# EAGLE design WRIST (EAGLE 9.6.2)
COMPANY: ADAFRUIT INDUSTRIES; DRAWN: KTOWN; REV: A
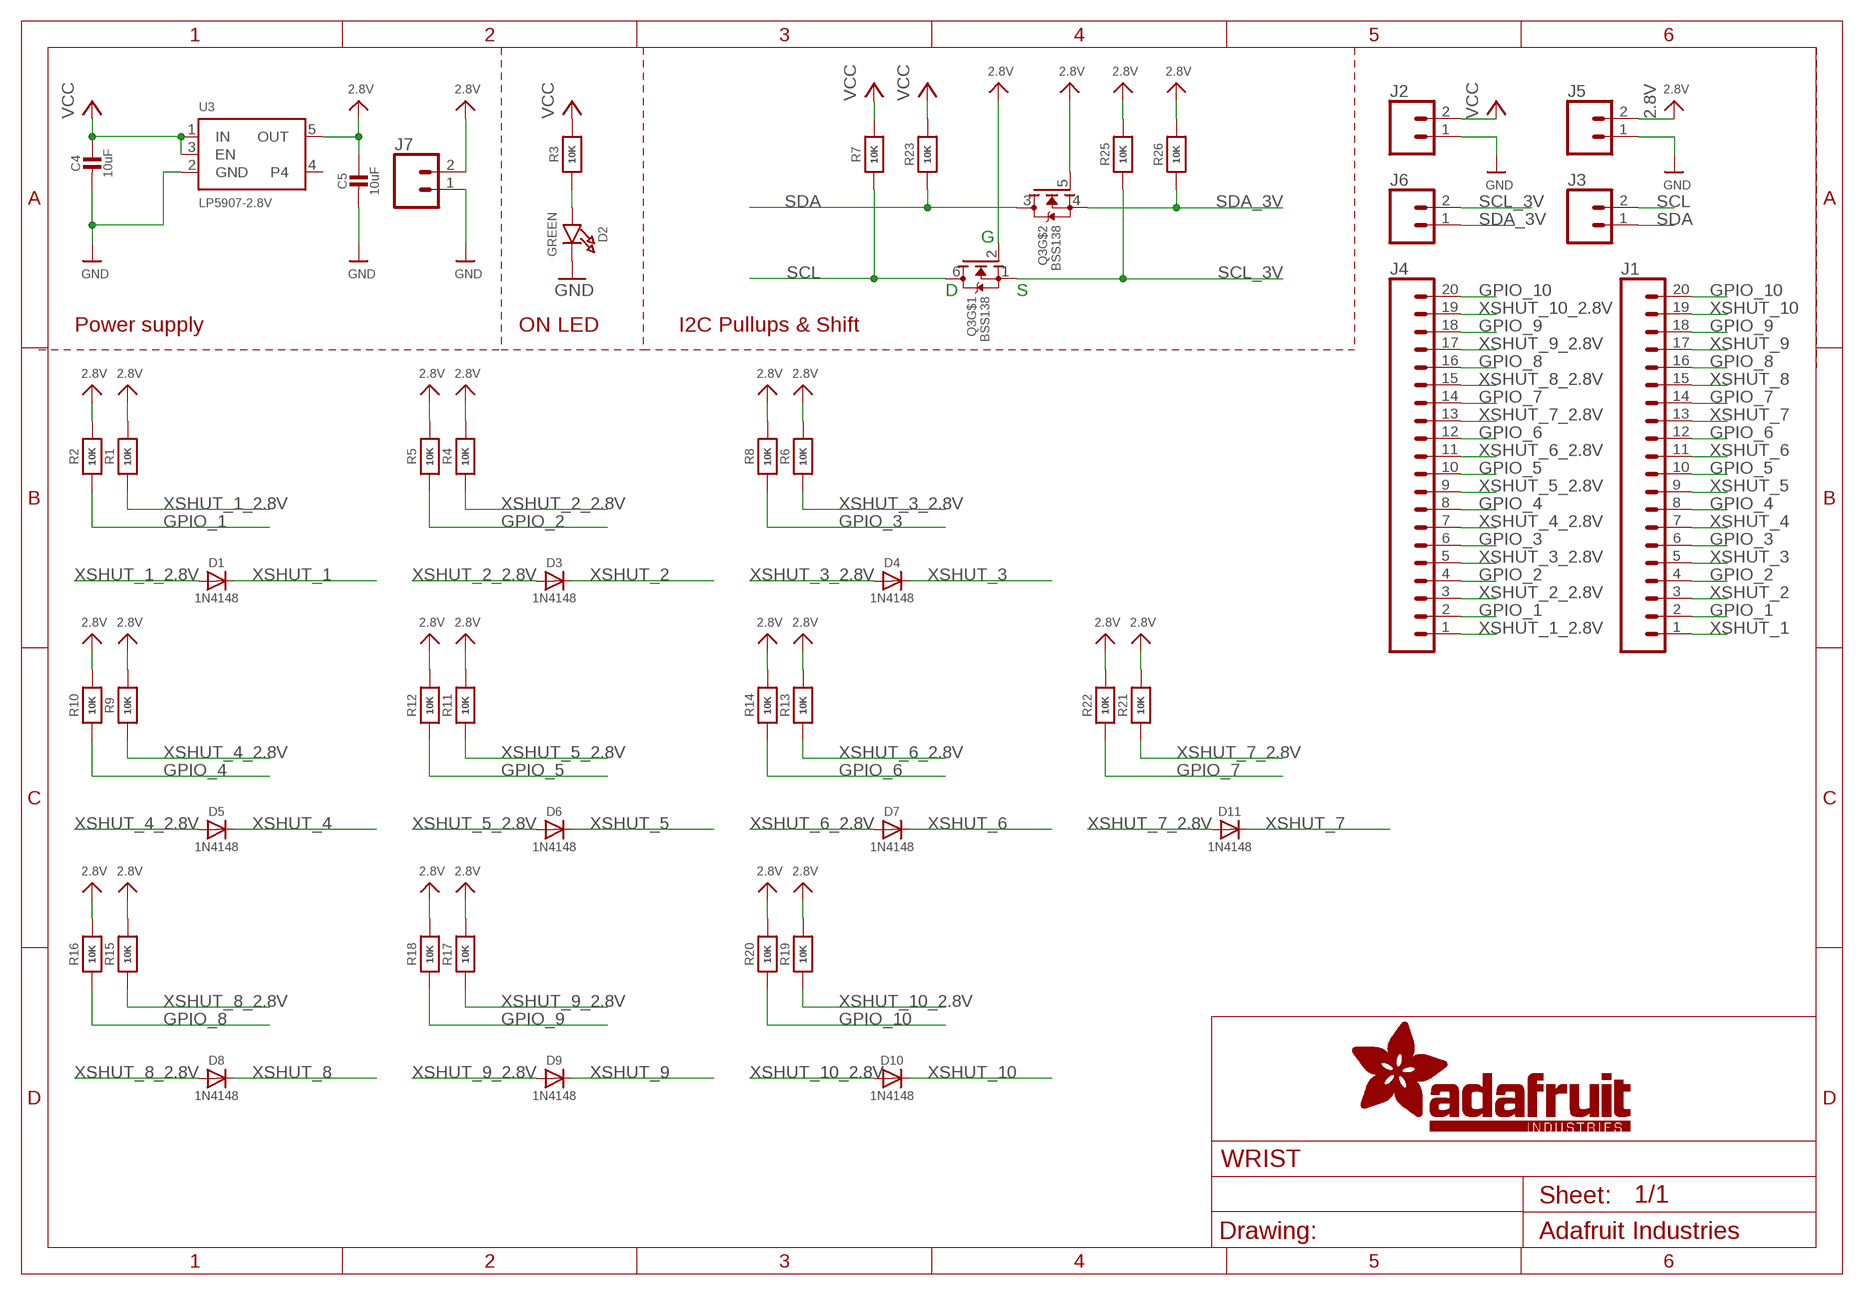
[diagram p0: schematic, sheet 1]

## Parts
C4  10uF  CAP_CERAMIC0805-NOOUTLINE  [0805-NO]
C5  10uF  CAP_CERAMIC0805-NOOUTLINE  [0805-NO]
D1  1N4148  DIODESOD-323  [SOD-323]
D2  GREEN  LED0603_NOOUTLINE  [CHIPLED_0603_NOOUTLINE]
D3  1N4148  DIODESOD-323  [SOD-323]
D4  1N4148  DIODESOD-323  [SOD-323]
D5  1N4148  DIODESOD-323  [SOD-323]
D6  1N4148  DIODESOD-323  [SOD-323]
D7  1N4148  DIODESOD-323  [SOD-323]
D8  1N4148  DIODESOD-323  [SOD-323]
D9  1N4148  DIODESOD-323  [SOD-323]
D10  1N4148  DIODESOD-323  [SOD-323]
D11  1N4148  DIODESOD-323  [SOD-323]
J1  CONN_20NOSILK  [1X20_NOSILK]
J2  CONN_021X02_NO_SILK  [1X02_NO_SILK]
J3  CONN_021X02_NO_SILK  [1X02_NO_SILK]
J4  CONN_20NOSILK  [1X20_NOSILK]
J5  CONN_021X02_NO_SILK  [1X02_NO_SILK]
J6  CONN_021X02_NO_SILK  [1X02_NO_SILK]
J7  CONN_021X02_NO_SILK  [1X02_NO_SILK]
Q3  BSS138  MOSFET-N_DUAL  [SOT363]
R1  10K  RESISTOR_0603_NOOUT  [0603-NO]
R2  10K  RESISTOR_0603_NOOUT  [0603-NO]
R3  10K  RESISTOR_0603_NOOUT  [0603-NO]
R4  10K  RESISTOR_0603_NOOUT  [0603-NO]
R5  10K  RESISTOR_0603_NOOUT  [0603-NO]
R6  10K  RESISTOR_0603_NOOUT  [0603-NO]
R7  10K  RESISTOR_0603_NOOUT  [0603-NO]
R8  10K  RESISTOR_0603_NOOUT  [0603-NO]
R9  10K  RESISTOR_0603_NOOUT  [0603-NO]
R10  10K  RESISTOR_0603_NOOUT  [0603-NO]
R11  10K  RESISTOR_0603_NOOUT  [0603-NO]
R12  10K  RESISTOR_0603_NOOUT  [0603-NO]
R13  10K  RESISTOR_0603_NOOUT  [0603-NO]
R14  10K  RESISTOR_0603_NOOUT  [0603-NO]
R15  10K  RESISTOR_0603_NOOUT  [0603-NO]
R16  10K  RESISTOR_0603_NOOUT  [0603-NO]
R17  10K  RESISTOR_0603_NOOUT  [0603-NO]
R18  10K  RESISTOR_0603_NOOUT  [0603-NO]
R19  10K  RESISTOR_0603_NOOUT  [0603-NO]
R20  10K  RESISTOR_0603_NOOUT  [0603-NO]
R21  10K  RESISTOR_0603_NOOUT  [0603-NO]
R22  10K  RESISTOR_0603_NOOUT  [0603-NO]
R23  10K  RESISTOR_0603_NOOUT  [0603-NO]
R25  10K  RESISTOR_0603_NOOUT  [0603-NO]
R26  10K  RESISTOR_0603_NOOUT  [0603-NO]
U3  LP5907-2.8V  VREG_SOT23-5  [SOT23-5]

## Nets
2.8V: C5.1 J5.2 J7.2 Q3.2(G) Q3.5(G) R1.2 R2.2 R4.2 R5.2 R6.2 R8.2 R9.2 R10.2 R11.2 R12.2 R13.2 R14.2 R15.2 R16.2 R17.2 R18.2 R19.2 R20.2 R21.2 R22.2 R25.2 R26.2 U3.5(OUT)
GND: C4.2 C5.2 D2.C J2.1 J5.1 J7.1 U3.2(GND)
GPIO_1: J1.2 J4.2 R2.1
GPIO_2: J1.4 J4.4 R5.1
GPIO_3: J1.6 J4.6 R8.1
GPIO_4: J1.8 J4.8 R10.1
GPIO_5: J1.10 J4.10 R12.1
GPIO_6: J1.12 J4.12 R14.1
GPIO_7: J1.14 J4.14 R22.1
GPIO_8: J1.16 J4.16 R16.1
GPIO_9: J1.18 J4.18 R18.1
GPIO_10: J1.20 J4.20 R20.1
N$1: D2.A R3.1
SCL: J3.2 Q3.6(D) R7.1
SCL_3V: J6.2 Q3.1(S) R25.1
SDA: J3.1 Q3.3(D) R23.1
SDA_3V: J6.1 Q3.4(S) R26.1
VCC [highpower]: C4.1 J2.2 R3.2 R7.2 R23.2 U3.1(IN) U3.3(EN)
XSHUT_1: D1.C J1.1
XSHUT_1_2.8V: D1.A J4.1 R1.1
XSHUT_2: D3.C J1.3
XSHUT_2_2.8V: D3.A J4.3 R4.1
XSHUT_3: D4.C J1.5
XSHUT_3_2.8V: D4.A J4.5 R6.1
XSHUT_4: D5.C J1.7
XSHUT_4_2.8V: D5.A J4.7 R9.1
XSHUT_5: D6.C J1.9
XSHUT_5_2.8V: D6.A J4.9 R11.1
XSHUT_6: D7.C J1.11
XSHUT_6_2.8V: D7.A J4.11 R13.1
XSHUT_7: D11.C J1.13
XSHUT_7_2.8V: D11.A J4.13 R21.1
XSHUT_8: D8.C J1.15
XSHUT_8_2.8V: D8.A J4.15 R15.1
XSHUT_9: D9.C J1.17
XSHUT_9_2.8V: D9.A J4.17 R17.1
XSHUT_10: D10.C J1.19
XSHUT_10_2.8V: D10.A J4.19 R19.1
Unconnected: U3.4

## Notes on the sheet
- G
- D | S
- Power supply | ON LED | I2C Pullups & Shift

## Library data of the parts
C4 C5 = microbuilder:CAP_CERAMIC: Ceramic Capacitors For new designs, use the packages preceded by an '_' character since they are more reliable: The following footprints should be used on most boards: _0402 - Standard footprint for regular board layouts _0603 - Standard footprint for regular board layouts _0805 - Standard footprint for regular board layouts _1206 - Standard footprint for regular board layouts For extremely tight-pitch boards where space is at a premium, the following 'micro-pitch' footprints can be used (smaller pads, no silkscreen outline, etc.): _0402MP - Micro-pitch footprint for very dense/compact boards _0603MP - Micro-pitch footprint for very dense/compact boards _0805MP - Micro-pitch footprint for very dense/compact boards _1206MP - Micro-pitch footprint for very dense/compact boards
D1 D3-D11 = microbuilder:DIODE: Diode SMA Model Volts Amps Type Vf Ir Digikey # Notes SSA34-E3 40V 3A Schottky 480mV @ 3A 200uA @ 40V SSA34-E3/61TGITR-ND CDBA120-G 20V 1A Schottky 500mV @ 1A 500uA @ 20V 641-1014-6-ND REEL MBRA210 10V 2A Schottky 350mV @ 2A 700uA @ 10V MBRA210LT3 SOD-123 Model Volts Amps Type Vf Ir Order # Notes BAT54T1G 30V 200mA Schottky 800mV @ 200mA 2uA @ 25V BAT54T1GOSTR-ND B0530W 30V 500mA Schottky 430mV @ 500mA 130uA @ 30V B0530W-FDICT-ND REEL MBR120 20V 1A Schottky 340mV @ 1A MBR120VLSFT1GOSCT-ND SOD-323 Model Volts Amps Type Vf Ir Order # Notes PMEG2005EJ 20V 500mA Schottky 355mV @ 500mA 568-4110-1-ND ZLLS410 10V 570mA Schottky 380mV @ 570mA ZLLS410CT-ND 1N4148WS 75V 150mA Silicon/Simple 1V 1N4148WSFSCT-ND REEL SOD-523 Model Volts Amps Type Vf Ir Order # Notes BAT54XV2 30V 200mA Schottky 0.8V @ 100mA BAT54XV2CT-ND TB751S 30V 30mA Schottky RB751S-40TE61CT-ND SOT23-R/W (R = Solder Paste/Reflow Ovens, W = Hand-Soldering) Model Volts Amps Type Vf Ir Order # Notes BAT54FILM 40V 300mA Schottky 497-7162-1-ND POWERDI-5 Model Volts Amps Type Vf Ir Order # Notes PDS560 60V 5A Schottky 670mV @ 5A 150uA @ 60V PDS560DICT-ND
D2 = microbuilder:LED: LED 0603 - 0603 Surface Mount Package 2mA: Green LED - Low Power (3.9mcd, 2ma, 1.7Vf) - Digikey: 475-2709-2-ND Orange LED - Low Power (9.8mcd, 2ma, 1.8Vf) - Digikey: 475-1194-2-ND Red LED - Low Power (5mcd, 2ma, 1.8Vf) - Digikey: 475-1195-2-ND Yellow LED - Low Power (7mcd, 2ma, 1.8Vf) - Digikey: 475-1196-2-ND 5mA: Blue LED - Low Power (17mcd, 5ma, 2.9Vf) - Digikey: LNJ937W8CRACT-ND 0805 - 0805 Surface Mount Package 2mA: Red LED (8.8mcd, 2mA, 1.8Vf, Clear) - Low Power [Digikey: 475-2510-1-ND] Green LED (5mcd, 2mA, 1.8Vf, Clear) - Low Power [Digikey: 475-2730-1-ND] Yellow LED (11.3mcd, 2mA, 1.8Vf, Clear) - Low Power [Digikey: 475-2555-1-ND] 20mA: Red LED (104mcd, 20mA, Diffused) - LS R976 [Digikey: 475-1278-6-ND] Red LED (12mcd, 20mA, 2.0Vf, Clear) - APT2012EC [Digikey: 754-1128-1-ND] Green LED (15mcd, 20mA, 2.2Vf, Clear) - APT2012GC [Digikey: 754-1131-1-ND] Orange LED (160mcd, 20mA, 2.1Vf, Clear) - APT2012SECK [Digikey: 754-1130-1-ND] 1206 - 1206 Surface Mount Package Green LED (26mcd, 20mA, Diffused) - LG N971 [Digikey: 475-1407-6-ND] Red LED (15mcd, 20mA, Diffused) - LH N974 [Digikey: 475-1416-6-ND] Cree - Cree High-Power Surface Mount LEDs XPEBWT-L1-0000-00D50 - White 111lm 350mA 2.9Vf 6200K 110° XTEAWT-00-0000-00000LEE3 - White 114lm 350mA 2.85Vf 5000K 115° Everlight - Everlight 45-21 Series Surface Mount LEDs 45-21/QK2C-B2832AC2CB2/2T - Warm White 2000mcd 20mA 3.25Vf 3050K 120° 45-21/LK2C-B38452C4CB2/2T - Nuetral White 2000mcd 20mA 3.25Vf 4150K 120° 45-21/LK2C-B50634C6CB2/2T - Cold White 2200mcd 20mA 3.25Vf 5650K 120° PLCC2 Reverse Mount LS T77K-J1L2-1-0-2-R18-Z - Red 11.25mcd 2mA 1.8Vf 630nm 120° LO T77K-L1M2-24-Z - Orange 19.6mcd 2mA 1.8Vf 606nm 120° LY T77K-K2M1-26-Z - Yellow 15.7mcd 2mA 1.8Vf 587nm 120°
J1 J4 = SparkFun-Connectors:CONN_20: Multi connection point. Often used as Generic Header-pin footprint for 0.1 inch spaced/style header connections On any of the 0.1 inch spaced packages, you can populate with these: Break Away Headers - Straight <https://www.sparkfun.com/products/116> (PRT-00116) Break Away Male Headers - Right Angle <https://www.sparkfun.com/products/553> (PRT-00553) Female Headers <https://www.sparkfun.com/products/115> (PRT-00115) Break Away Headers - Machine Pin <https://www.sparkfun.com/products/117> (PRT-00117) Break Away Female Headers - Swiss Machine Pin <https://www.sparkfun.com/products/743> (PRT-00743) For SCREWTERMINALS and SPRING TERMINALS visit here: Screw Terimnals on SparkFun.com <https://www.sparkfun.com/search/results?term=Screw+Terminals> (5mm/3.5mm/2.54mm spacing) This device is also useful as a general connection point to wire up your design to another part of your project. Our various solder wires solder well into these plated through hole pads. Hook-Up Wire - Assortment (Stranded, 22 AWG) <https://www.sparkfun.com/products/11375> (PRT-11375) Hook-Up Wire - Assortment (Solid Core, 22 AWG) <https://www.sparkfun.com/products/11367> (PRT-11367) View the entire wire category on our website here <https://www.sparkfun.com/categories/141> Special notes: Molex polarized connector foot print use with SKU : PRT-08231 with associated crimp pins and housings. 1MM SMD Version SKU: PRT-10208 NOTES ON THE VARIANTS LOCK and LOCK_LONGPADS... This footprint was designed to help hold the alignment of a through-hole component (i.e. 6-pin header) while soldering it into place. You may notice that each hole has been shifted either up or down by 0.005 of an inch from it's more standard position (which is a perfectly straight line). This slight alteration caused the pins (the squares in the middle) to touch the edges of the holes. Because they are alternating, it causes a "brace" to hold the component in place. 0.005 has proven to be the perfect amount of "off-center" position when using our standard breakaway headers. Although looks a little odd when you look at the bare footprint, once you have a header in there, the alteration is very hard to notice. Also,if you push a header all the way into place, it is covered up entirely on the bottom side. Note about LOCK SPECIAL package: This is just like the LOCK variant in that the holes are staggared by 5 mil, but except for the last two holes. They are not altered from the "standard" footprint layout. This is used for a special purpose on the layout of our Graphic LCD Backpack. Make sure you want to use this device before selecting it for you project!
J2 J3 J5-J7 = SparkFun-Connectors:CONN_02: Multi connection point. Often used as Generic Header-pin footprint for 0.1 inch spaced/style header connections On any of the 0.1 inch spaced packages, you can populate with these: Break Away Headers - Straight <https://www.sparkfun.com/products/116> (PRT-00116) Break Away Male Headers - Right Angle <https://www.sparkfun.com/products/553> (PRT-00553) Female Headers <https://www.sparkfun.com/products/115> (PRT-00115) Break Away Headers - Machine Pin <https://www.sparkfun.com/products/117> (PRT-00117) Break Away Female Headers - Swiss Machine Pin <https://www.sparkfun.com/products/743> (PRT-00743) For SCREWTERMINALS and SPRING TERMINALS visit here: Screw Terimnals on SparkFun.com <https://www.sparkfun.com/search/results?term=Screw+Terminals> (5mm/3.5mm/2.54mm spacing) This device is also useful as a general connection point to wire up your design to another part of your project. Our various solder wires solder well into these plated through hole pads. Hook-Up Wire - Assortment (Stranded, 22 AWG) <https://www.sparkfun.com/products/11375> (PRT-11375) Hook-Up Wire - Assortment (Solid Core, 22 AWG) <https://www.sparkfun.com/products/11367> (PRT-11367) View the entire wire category on our website here <https://www.sparkfun.com/categories/141> Special notes: Molex polarized connector foot print use with: PRT-08233 with associated crimp pins and housings. 2.54_SCREWTERM for use with PRT-10571. 3.5mm Screw Terminal footprints for PRT-08084 5mm Screw Terminal footprints for use with PRT-08432
Q3 = microbuilder:MOSFET-N_DUAL: Dual N-Channel MOSFET SOT363 (2.0x1.25mm) 2N7002PS - 60V, 320mA [Digikey: 568-5984-1-ND]
R1-R23 R25 R26 = microbuilder:RESISTOR: Resistors For new designs, use the packages preceded by an '_' character since they are more reliable: The following footprints should be used on most boards: _0402 - Standard footprint for regular board layouts _0603 - Standard footprint for regular board layouts _0805 - Standard footprint for regular board layouts _1206 - Standard footprint for regular board layouts For extremely tight-pitch boards where space is at a premium, the following 'micro-pitch' footprints can be used (smaller pads, no silkscreen outline, etc.): _0402MP - Micro-pitch footprint for very dense/compact boards _0603MP - Micro-pitch footprint for very dense/compact boards _0805MP - Micro-pitch footprint for very dense/compact boards _1206MP - Micro-pitch footprint for very dense/compact boards
U3 = microbuilder:VREG_SOT23-5: SOT23-5 Fixed Voltage Regulators Part Current Out V Out V In V Dropout θJA (°C/W) TJ (°C) Digikey Part No. ADP121 150mA 3.3V 3.4-5.5V 0.09V @ 150mA -- -- ADP121-AUJZ33R7CT-ND ADP121 150mA 3.0V 3.1-5.5V 0.09V @ 150mA -- -- ADP121-AUJZ30R7CT-ND ADP122 300mA 3.3V 3.4-5.5V 0.085V @ 300mA -- -- ADP122AUJZ-3.3-R7CT-ND ADP1712 300mA 3.3V 3.5-5.5V 0.17V @ 300mA -- -- ADP1712AUJZ-3.3-R7TR-ND AP7311 (Low Cost) 150mA 3.3V 3.5-6V 0.15V @ 150mA -- -- AP7311-33WG-7DICT-ND LD39015M18R 150mA 1.8V 1.9V-5.5V 0.08V @ 100mA -- -- 497-6977-1-ND LP2985A-33DBVR 150mA 3.3V 3.3-16V 0.28V @ 150mA 206 150 296-18479-1-ND MCP1824T-3302E/OT 300mA 3.3V 3.5V-6V 0.2V @ 300mA -- -- MCP1824T-3302E/OTCT-ND MIC5205-2.5YM5 TR 150mA 2.5V 2.7-16V 0.165V @ 150mA -- -- 576-1257-2-ND MIC5205-3.0YM5 TR 150mA 3.0V 3.2V-16V 0.165V @ 150mA -- -- 576-1258-2-ND MIC5205-3.3YM5 TR 150mA 3.3V 3.5V-16V 0.165V @ 150mA -- -- 576-1259-2-ND TPS780330220 150mA 3.3V+2.2V 3.6-5.5V 250mV Max -- -- 296-23332-1-ND TDA3663/N1,135 100mA 3.3V 3.5-45V 0.18V @ 50mA -- -- 568-5343-1-ND Max operating temp can be calculated using θJA, TJ (max junction temperature), and power in watts. Set the "Maximum Ambient Temperature" until it reaches TJ ("Max Junction Temperature"), which is the absolute limit for safe use of the regulator: Heat Sink Temperature Calculator <http://www.daycounter.com/Calculators/Heat-Sink-Temperature-Calculator.phtml> For example, With 12V source into a 3.3V LP2985 and a 30mA load, we are dissipating (12V-3.3V) * 0.03A = 0.261W. With a θJA of 206 °C/W, a TJ of 150°C, and 261mW we can safely use the chip without a heat sink up to 75°C (=147.1°C Junction Temperature).

## Net classes
1 highpower: width 0.406 mm, drill 0.483 mm
2 lowpower: width 0.305 mm, drill 0.483 mm

## Board
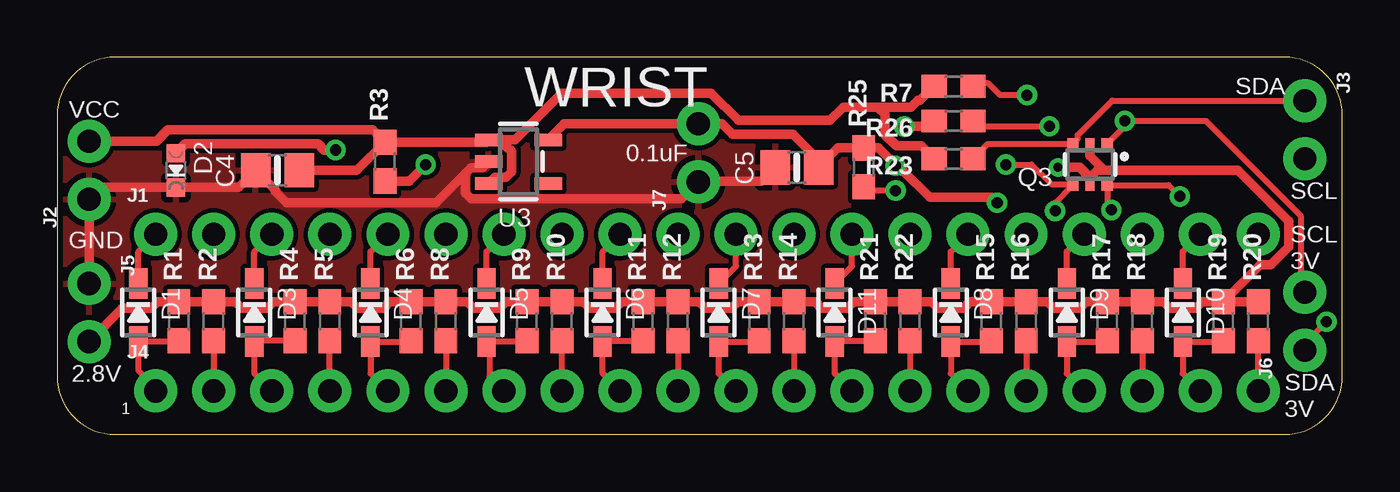
[diagram p1: board, top side]
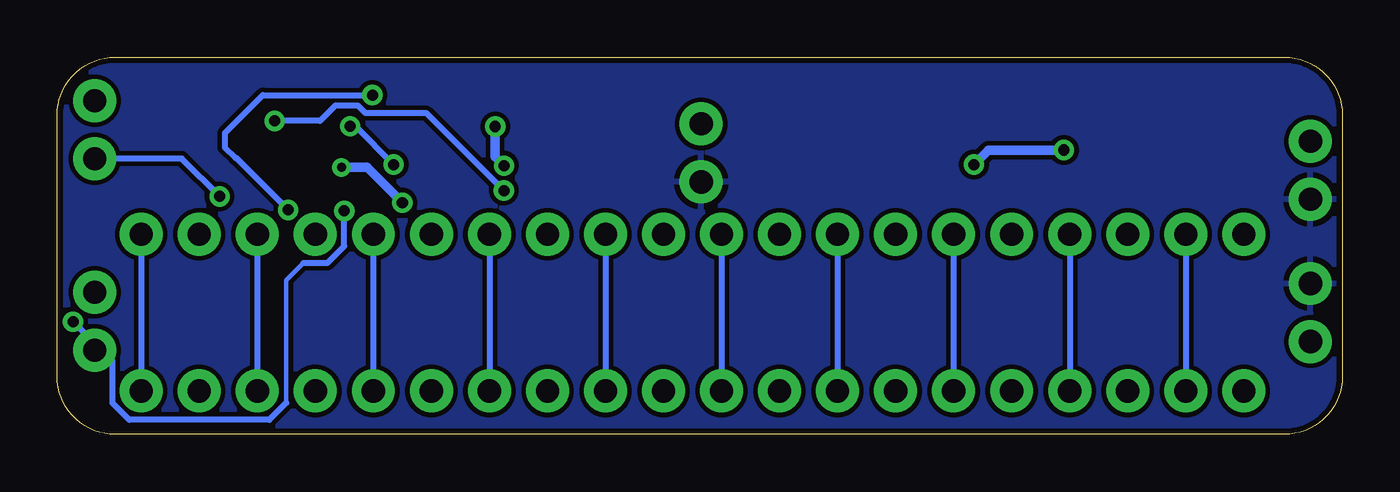
[diagram p2: board, bottom side, seen from below]

Size 56.26 x 16.51 mm. Coordinates in mm from the lower left corner, seen from the top.
Outline: 0,13.97 0,2.54 arc90 2.54,0 53.72,0 arc90 56.26,2.54 56.26,13.97 arc90 53.72,16.51 2.54,16.51 arc90 0,13.97
Copper layers (1*16): Top 0.035mm / dielectric 1.5mm / Bottom 0.035mm
Design rules "adafruit *": minimum track width 8mil, minimum drill 15.5mil, track to track 8mil, track to pad 8mil, pad to pad 8mil, via to via 8mil, smd to smd 8mil, copper to edge 10mil, drill to drill 8mil, minimum pad ring 10mil, minimum via ring 8mil, stop-mask expansion 2mil, vias tented up to drill 20mil, thermal gap 10mil

### Footprints (pad centres in the part's own frame; a part is rotated, then mirrored left to right if it is on the bottom)
0805-NO = smd 1.3 x 1.5: 1 -0.95,0; 2 0.95,0
SOD-323 = smd 1.35 x 0.8: A 1.27,0; C -1.27,0
CHIPLED_0603_NOOUTLINE = smd 0.8 x 0.8: A 0,-0.75; C 0,0.75
1X20_NOSILK = drill 1.016 pad 1.88: 1 0,0; 2 2.54,0; 3 5.08,0; 4 7.62,0; 5 10.16,0; 6 12.7,0; 7 15.24,0; 8 17.78,0; 9 20.32,0; 10 22.86,0; 11 25.4,0; 12 27.94,0; 13 30.48,0; 14 33.02,0; 15 35.56,0; 16 38.1,0; 17 40.64,0; 18 43.18,0; 19 45.72,0; 20 48.26,0
1X02_NO_SILK = drill 1.016 pad 1.88: 1 0,0; 2 2.54,0
SOT363 = smd 0.5 x 0.5: 1 -0.75,-0.9; 3 0.75,-0.9; 4 0.75,0.9; 6 -0.75,0.9 | smd 0.4 x 0.5: 2 0,-0.9; 5 0,0.9
0603-NO = smd 1.1 x 1: 1 -0.85,0; 2 0.85,0
SOT23-5 = smd 0.55 x 1.2: 1 -0.95,-1.3; 2 0,-1.3; 3 0.95,-1.3; 4 0.95,1.3; 5 -0.95,1.3

### Placement (x,y rotation side)
C4  9.65,11.56 180 top
C5  32.38,11.68 180 top
D1  3.56,5.33 270 top
D2  5.21,11.56 180 top
D3  8.64,5.33 270 top
D4  13.72,5.33 270 top
D5  18.8,5.33 270 top
D6  23.88,5.33 270 top
D7  28.96,5.33 270 top
D8  39.12,5.33 270 top
D9  44.2,5.33 270 top
D10  49.28,5.33 270 top
D11  34.04,5.33 270 top
J1  4.32,8.76 0 top
J2  1.4,10.29 90 top
J3  54.61,14.61 270 top
J4  4.32,1.91 0 top
J5  1.4,6.6 270 top
J6  54.61,3.68 90 top
J7  28.07,11.05 90 top
Q3  45.21,11.81 180 top
R1  5.33,4.95 90 top
R2  6.86,4.95 90 top
R3  14.35,11.94 90 top
R4  10.41,4.95 90 top
R5  11.94,4.95 90 top
R6  15.49,4.95 90 top
R7  39.24,15.24 180 top
R8  17.02,4.95 90 top
R9  20.57,4.95 90 top
R10  22.1,4.95 90 top
R11  25.65,4.95 90 top
R12  27.18,4.95 90 top
R13  30.73,4.95 90 top
R14  32.26,4.95 90 top
R15  40.89,4.95 90 top
R16  42.42,4.95 90 top
R17  45.97,4.95 90 top
R18  47.5,4.95 90 top
R19  51.05,4.95 90 top
R20  52.58,4.95 90 top
R21  35.81,4.95 90 top
R22  37.34,4.95 90 top
R23  39.24,12.06 180 top
R25  35.31,11.68 90 top
R26  39.24,13.72 180 top
U3  20.19,11.94 270 top

### Tracks (layer width: path | path; a pad name or v marks a point on that pad's centre or on a via)
2.8V  (via drill 0.39, 0.48)
  Top 0.406: R19.2 50.12,5.8 49.84,5.52 48.71,5.52 48.43,5.8 R18.2 R17.2 45.05,5.8 44.76,5.52 43.63,5.52 43.35,5.8 R16.2 R15.2 39.97,5.8 39.68,5.52 38.55,5.52 38.27,5.8 R22.2 R21.2 34.88,5.8 34.6,5.52 33.47,5.52 33.19,5.8 R14.2 R13.2 29.8,5.8 29.52,5.52 28.39,5.52 28.11,5.8 R12.2 R11.2 24.73,5.8 24.44,5.52 23.31,5.52 23.03,5.8 R10.2 R9.2 19.64,5.8 19.36,5.52 18.23,5.52 17.95,5.8 R8.2 R6.2 14.56,5.8 14.28,5.52 13.15,5.52 12.87,5.8 R5.2 R4.2 9.48,5.8 9.2,5.52 8.07,5.52 7.79,5.8 R2.2 R1.2 4.41,5.8 4.12,5.52 2.86,5.52 J5.2 | R19.2 R20.2 | 45.85,11.57 51.68,11.57 53.92,9.32 53.92,8.21 53.14,7.42 52.67,7.42 R19.2 | 45.85,11.57 45.54,11.57 45.21,11.24 | v41.15,10.14 40.91,10.38 38.2,10.38 37.05,11.52 | 45.21,11.24 Q3.5 | 45.85,11.57 45.21,12.2 Q3.2 | v43.81,11.68 44.76,11.68 45.21,11.24 | C5.1 33.49,11.84 | 33.49,11.84 34.19,12.53 R25.2 35.96,12.53 36.48,12.01 36.56,12.01 37.05,11.52 | v36.7,11.76 36.94,11.52 37.05,11.52 | R26.2 38.15,13.47 v37.08,13.47 | U3.5 22.19,13.59 J7.2 29.11,13.59 29.56,13.13 32.2,13.13 33.49,11.84
  Bottom 0.406: v43.81,11.68 42.7,11.68 v41.15,10.14 | v37.08,13.47 37.08,12.14 v36.7,11.76
GND
  Top 0.406: J5.1 J2.1 1.92,10.81 D2.C 7.95,10.81 C4.2 9.55,10.71 9.55,10.64 10.05,10.13 16.59,10.13 17.89,11.43 | C5.2 30.84,11.09 28.11,11.09 J7.1 27.32,10.31 18.12,10.31 17.89,10.54 17.89,11.43 | 17.89,11.43 18.12,11.67 18.62,11.67 U3.2
  pour Top: 0,16.51 56.26,16.51 56.26,0 0,0
  pour Bottom: 0,16.51 56.26,16.51 56.26,0 0,0
GPIO_1
  Top 0.254: R2.1 J4.2
  Bottom 0.254: J1.2 J4.2
GPIO_2
  Top 0.254: J4.4 R5.1
  Bottom 0.254: J1.4 J4.4
GPIO_3
  Top 0.254: R8.1 J4.6
  Bottom 0.254: J1.6 J4.6
GPIO_4
  Top 0.254: J4.8 R10.1
  Bottom 0.254: J1.8 J4.8
GPIO_5
  Top 0.254: R12.1 J4.10
  Bottom 0.254: J1.10 J4.10
GPIO_6
  Top 0.254: R14.1 J4.12
  Bottom 0.254: J1.12 J4.12
GPIO_7
  Top 0.254: R22.1 J4.14
  Bottom 0.254: J1.14 J4.14
GPIO_8
  Top 0.254: R16.1 42.42,3.94 J4.16
  Bottom 0.254: J1.16 J4.16
GPIO_9
  Top 0.254: R18.1 J4.18
  Bottom 0.254: J1.18 J4.18
GPIO_10
  Top 0.254: J4.20 R20.1
  Bottom 0.254: J1.20 J4.20
N$1  (via drill 0.48)
  Top 0.406: v12.19,12.45 11.69,12.45 11.42,12.71 5.61,12.71 D2.A | v16.13,11.81 15.41,11.09 R3.1
  Bottom 0.406: v12.19,12.45 15.49,12.45 v16.13,11.81
SCL  (via drill 0.48)
  Top 0.254: v49.15,10.41 48.65,10.91 Q3.6 45.96,10 v46.14,9.82 | v42.46,14.85 41.28,14.85 40.77,15.37 40.22,15.37 R7.1
  Bottom 0.254: v49.15,10.41 50.8,12.06 J3.2 | v46.14,9.82 48.42,12.1 48.45,12.1 48.91,12.55 48.91,13.2 47.25,14.85 v42.46,14.85
SCL_3V  (via drill 0.48)
  Top 0.254: J6.2 54.46,6.38 54.46,9.54 50.28,13.72 v46.74,13.72 46.74,13.48 Q3.1 | v36.7,10.67 35.47,10.67 R25.1
  Bottom 0.254: v46.74,13.72 44.76,13.72 44.08,14.39 43.1,14.39 42.78,14.08 40.11,14.08 v36.7,10.67
SDA
  Top 0.254: J3.1 46.19,14.61 44.68,13.1 44.68,12.93 Q3.3 40.74,12.71 R23.1
SDA_3V  (via drill 0.48)
  Top 0.254: J6.1 54.61,3.98 v55.56,4.93 | v43.69,9.78 43.69,10.15 Q3.4 44.42,10.95 43.51,10.95 42.66,11.81 v41.53,11.81 | R26.1 40.32,13.49 v43.43,13.49
  Bottom 0.203: 45.48,7.49 46.23,6.75 46.23,1.38
  Bottom 0.254: v43.69,9.78 43.69,8.24 44.43,7.49 45.48,7.49 | v55.56,4.93 53.85,3.22 53.85,1.38 53.1,0.64 46.97,0.64 46.23,1.38 | v43.43,13.49 43.2,13.49 v41.53,11.81
VCC
  Top 0.406: C4.1 13.12,11.56 R3.2 | R3.2 18.79,12.79 18.83,12.83 | 18.83,12.83 U3.1 20.04,12.89 22.09,14.94 28.62,14.94 29.82,13.74 33.84,13.74 34.42,14.33 35.94,14.33 | U3.3 19.16,11.26 19.66,11.26 19.9,11.49 19.9,12.38 19.66,12.62 19.64,12.62 19.43,12.83 18.83,12.83 | J2.2 4.35,12.83 4.85,13.32 13.82,13.32 R3.2 | R23.2 37.83,12.62 36.73,12.62 36.23,13.12 36.23,14.03 35.94,14.33 | R7.2 37.77,14.62 37.67,14.62 37.38,14.33 35.94,14.33
XSHUT_1
  Top 0.254: D1.C 3.56,8 J1.1
XSHUT_1_2.8V
  Top 0.254: R1.1 5.29,4.06 D1.A 3.56,2.79 4.32,2.03 J4.1
XSHUT_2
  Top 0.254: D3.C 8.64,8 J1.3
XSHUT_2_2.8V
  Top 0.254: R4.1 8.8,4.1 8.7,4 D3.A 8.64,2.67 J4.3
XSHUT_3
  Top 0.254: D4.C 13.72,8 J1.5
XSHUT_3_2.8V
  Top 0.254: R6.1 15.46,4.06 D4.A 13.72,2.67 J4.5
XSHUT_4
  Top 0.254: D5.C 18.8,8 J1.7
XSHUT_4_2.8V
  Top 0.254: R9.1 20.54,4.06 D5.A 18.92,3.94 18.92,2.54 J4.7
XSHUT_5
  Top 0.254: D6.C 23.88,8 J1.9
XSHUT_5_2.8V
  Top 0.254: J4.9 23.88,2.67 D6.A 23.91,4.1 R11.1
XSHUT_6
  Top 0.254: D7.C 29.72,7.37 J1.11
XSHUT_6_2.8V
  Top 0.254: J4.11 28.96,2.67 D7.A 30.7,4.06 R13.1
XSHUT_7
  Top 0.254: D11.C 34.8,7.37 J1.13
XSHUT_7_2.8V
  Top 0.254: J4.13 34.04,2.67 D11.A 34.08,4.1 R21.1
XSHUT_8
  Top 0.254: D8.C 39.12,8 J1.15
XSHUT_8_2.8V
  Top 0.254: J4.15 39.12,2.67 D8.A 40.85,4.06 R15.1
XSHUT_9
  Top 0.254: D9.C 44.2,8 J1.17
XSHUT_9_2.8V
  Top 0.254: R17.1 45.94,4.06 D9.A 44.2,2.67 J4.17
XSHUT_10
  Top 0.254: D10.C 49.28,8 J1.19
XSHUT_10_2.8V
  Top 0.254: R19.1 51.02,4.06 D10.A 49.28,2.67 J4.19

### Text on the board
tPlace: SDA | VCC | WRIST | 0.1uF | SCL | GND | SCL / 3V | 2.8V | 1 | SDA / 3V